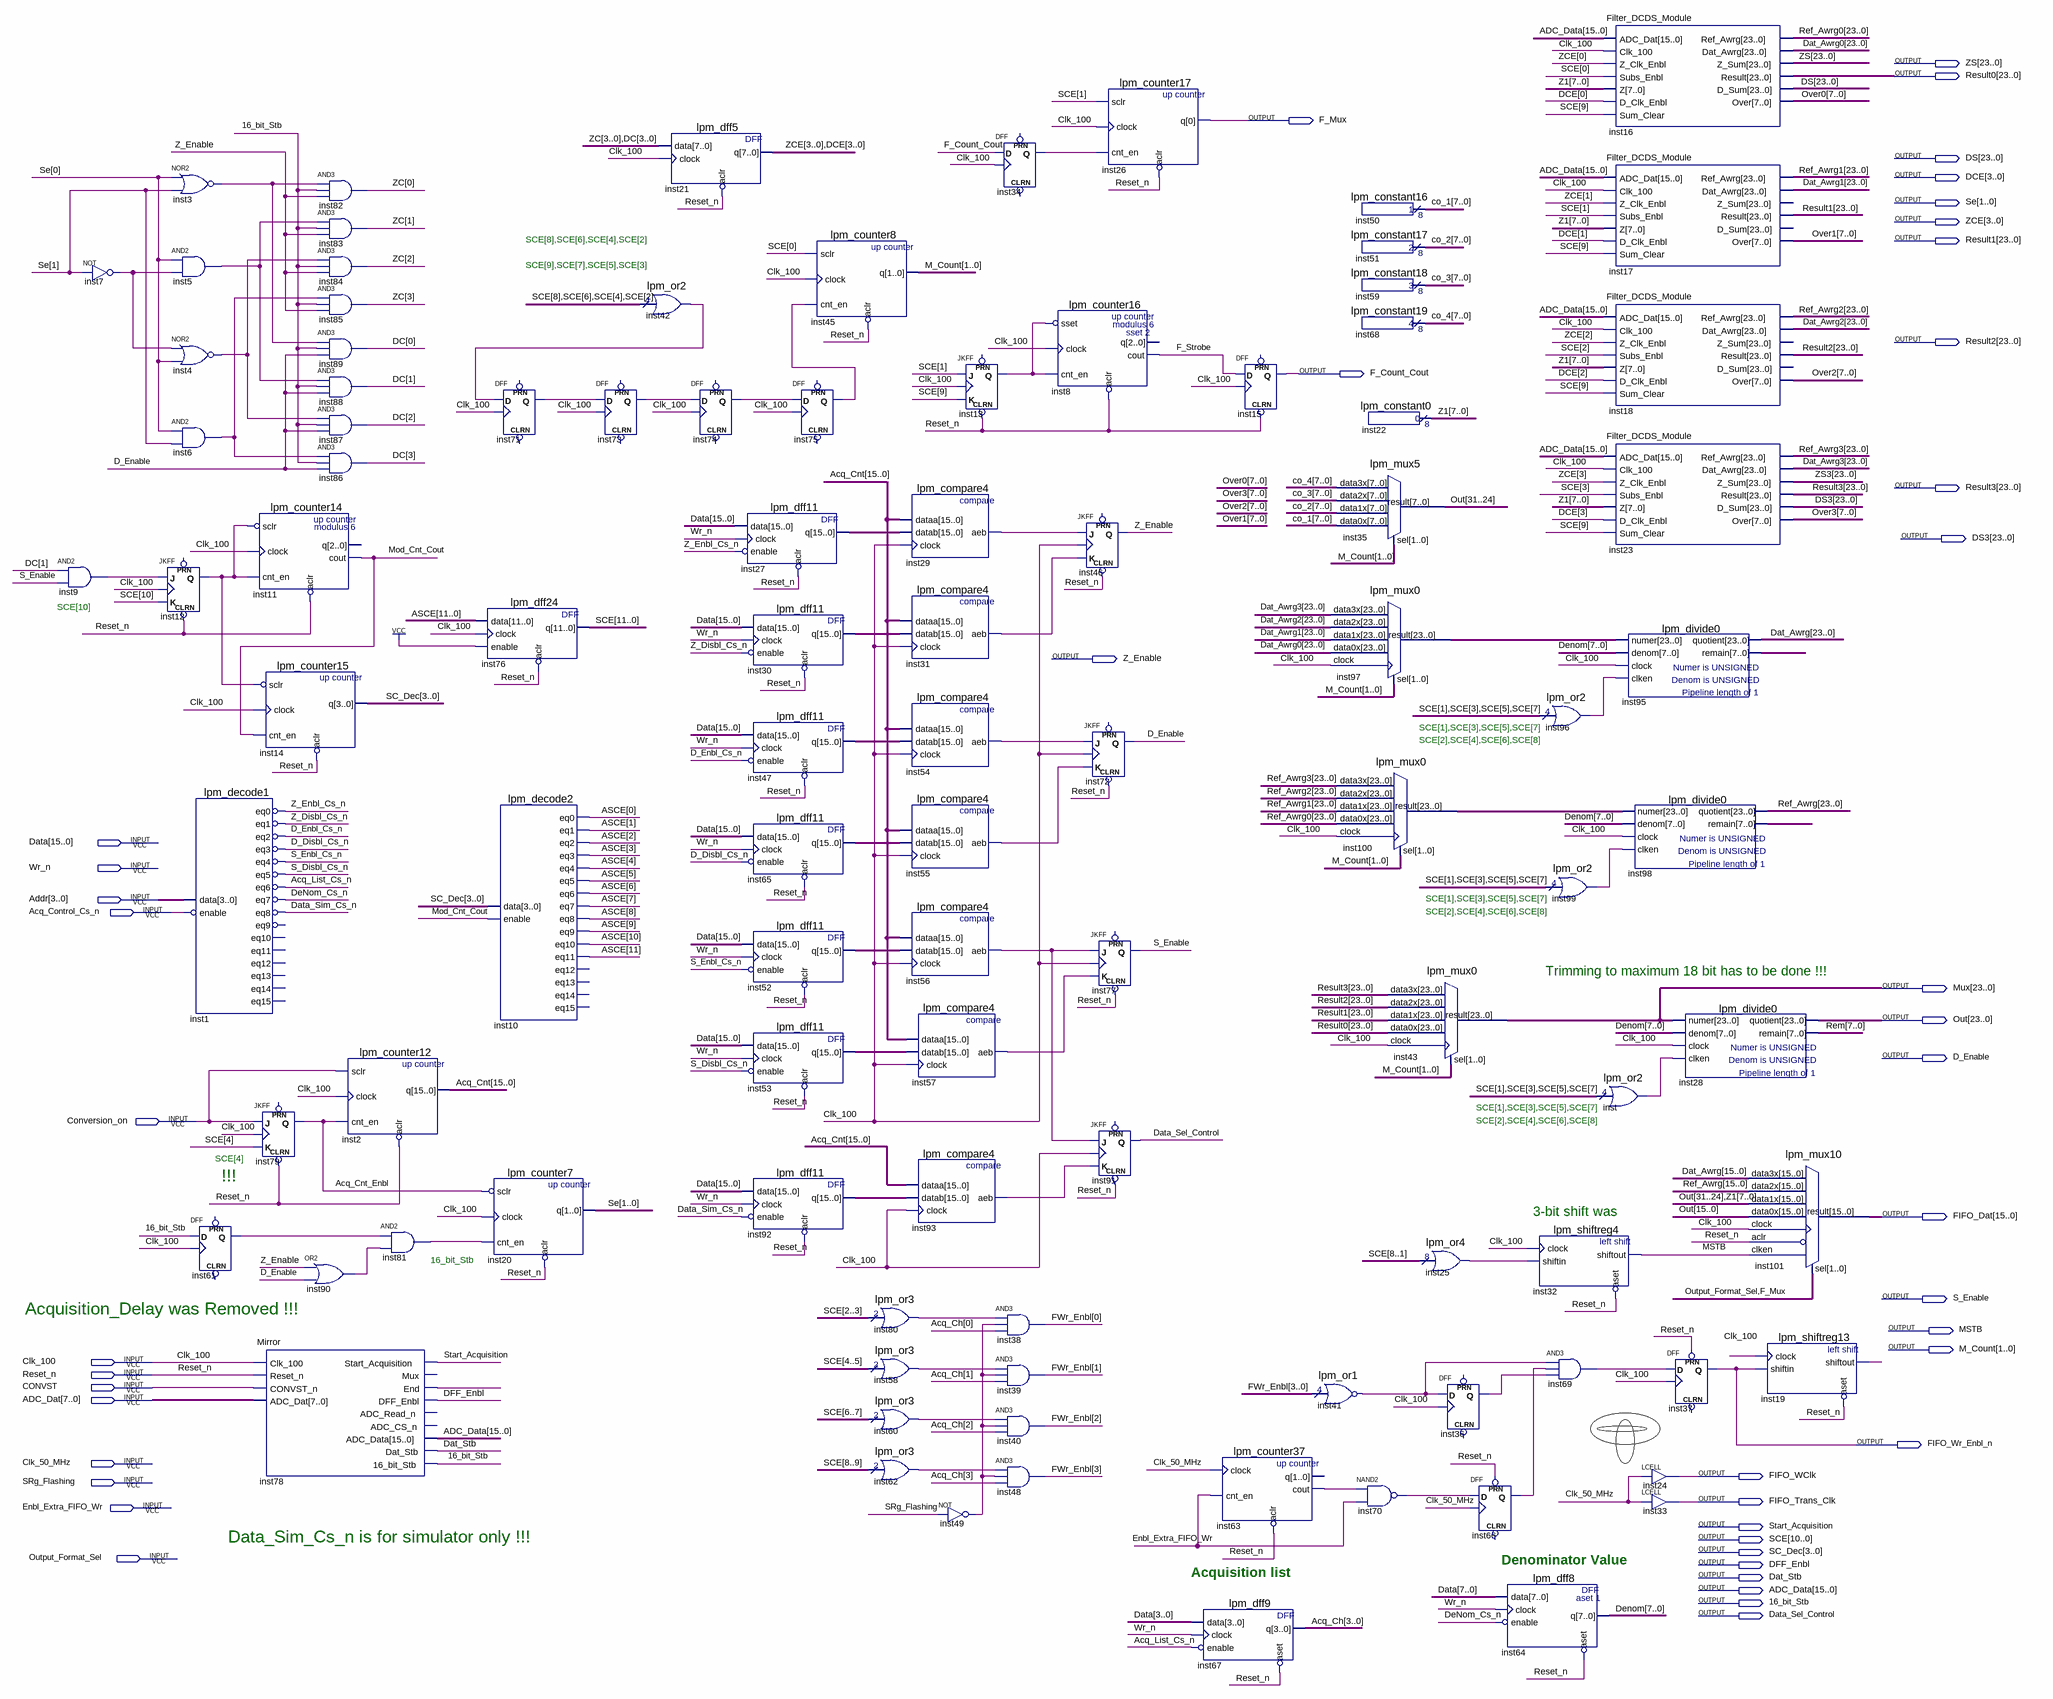
[diagram p0: schematic sheet]
// Quartus schematic Acuisition_Control_Module.bdf as structural Verilog: 100 symbols, 44 pins
module Acuisition_Control_Module (
  input  [15:0] Data,
  input  Wr_n,
  input  [3:0] Addr,
  input  Acq_Control_Cs_n,
  input  Conversion_on,
  input  Clk_100,
  input  Reset_n,
  input  CONVST,
  input  [7:0] ADC_Dat,
  input  Clk_50_MHz,
  input  SRg_Flashing,
  input  Enbl_Extra_FIFO_Wr,
  input  Output_Format_Sel,
  output [23:0] ZS,
  output [23:0] Result0,
  output F_Mux,
  output [23:0] DS,
  output [3:0] DCE,
  output [1:0] Se,
  output [3:0] ZCE,
  output [23:0] Result1,
  output [23:0] Result2,
  output F_Count_Cout,
  output [23:0] Result3,
  output [23:0] DS3,
  output Z_Enable,
  output [23:0] Mux,
  output [31:0] Out,
  output D_Enable,
  output [15:0] FIFO_Dat,
  output S_Enable,
  output MSTB,
  output [1:0] M_Count,
  output FIFO_Wr_Enbl_n,
  output FIFO_WClk,
  output FIFO_Trans_Clk,
  output Start_Acquisition,
  output [11:0] SCE,
  output [3:0] SC_Dec,
  output DFF_Enbl,
  output Dat_Stb,
  output [15:0] ADC_Data,
  output \16_bit_Stb ,
  output Data_Sel_Control
);

  wire Acq_Cnt_Enbl, Acq_List_Cs_n, D_Disbl_Cs_n, D_Enbl_Cs_n, Data_Sim_Cs_n, DeNom_Cs_n, F_Strobe,
       inst1_eq0, inst1_eq1, inst1_eq2, inst1_eq3, inst1_eq4, inst1_eq5, inst1_eq6, inst1_eq7, inst1_eq8,
       inst3_out, inst4_out, inst5_out, inst6_out, inst7_out, inst9_out, inst12_q, inst13_q, inst19_shiftout,
       inst25_result, inst29_aeb, inst31_aeb, inst34_q, inst36_q, inst41_result, inst41_result_inverted_out,
       inst42_result, inst49_out, inst54_aeb, inst55_aeb, inst56_aeb, inst57_aeb, inst58_result,
       inst60_result, inst61_q, inst62_result, inst63_cout, inst66_q, inst69_out, inst70_out, inst71_q,
       inst73_q, inst74_q, inst75_q, inst78_end, inst80_result, inst81_out, inst90_out, inst93_aeb,
       inst96_result, inst99_result, inst_result, Mod_Cnt_Cout, S_Disbl_Cs_n, S_Enbl_Cs_n, Z_Disbl_Cs_n,
       Z_Enbl_Cs_n;
  wire [3:0] Acq_Ch, DC, FWr_Enbl, ZC;
  wire [7:0] co_1, co_2, co_3, co_4, Denom, inst95_remain, inst98_remain, Over0, Over1, Over2, Over3, Rem, Z1;
  wire [11:0] ASCE;
  wire [15:0] Acq_Cnt, inst27_q, inst30_q, inst47_q, inst52_q, inst53_q, inst65_q, inst92_q;
  wire [23:0] Dat_Awrg, Dat_Awrg0, Dat_Awrg1, Dat_Awrg2, Dat_Awrg3, inst97_result, inst100_result, Ref_Awrg,
       Ref_Awrg0, Ref_Awrg1, Ref_Awrg2, Ref_Awrg3, ZS3;

  and inst9 (inst9_out, DC[1], S_Enable);
  not inst7 (inst7_out, Se[1]);
  JKFF inst12 (.CLRN(Reset_n), .K(SCE[10]), .J(inst9_out), .CLK(Clk_100), .Q(inst12_q));  // open: PRN
  nor inst3 (inst3_out, Se[0], Se[1]);
  and inst5 (inst5_out, Se[0], inst7_out);
  nor inst4 (inst4_out, inst7_out, Se[0]);
  and inst6 (inst6_out, Se[0], Se[1]);
  lpm_decode1 inst1 (
    .data(Addr), .enable(~Acq_Control_Cs_n), .eq0(inst1_eq0), .eq1(inst1_eq1), .eq2(inst1_eq2),
    .eq3(inst1_eq3), .eq4(inst1_eq4), .eq5(inst1_eq5), .eq6(inst1_eq6), .eq7(inst1_eq7), .eq8(inst1_eq8));  // open: eq9, eq10, eq11, eq12, eq13, eq14, eq15
  not inst1_eq0_inverted (Z_Enbl_Cs_n, inst1_eq0);
  not inst1_eq1_inverted (Z_Disbl_Cs_n, inst1_eq1);
  not inst1_eq2_inverted (D_Enbl_Cs_n, inst1_eq2);
  not inst1_eq3_inverted (D_Disbl_Cs_n, inst1_eq3);
  not inst1_eq4_inverted (S_Enbl_Cs_n, inst1_eq4);
  not inst1_eq5_inverted (S_Disbl_Cs_n, inst1_eq5);
  not inst1_eq6_inverted (Acq_List_Cs_n, inst1_eq6);
  not inst1_eq7_inverted (DeNom_Cs_n, inst1_eq7);
  not inst1_eq8_inverted (Data_Sim_Cs_n, inst1_eq8);
  DFF inst61 (.CLK(Clk_100), .D(\16_bit_Stb ), .Q(inst61_q));  // open: CLRN, PRN
  lpm_counter14 inst11 (
    .sclr(~inst12_q), .clock(Clk_100), .cnt_en(inst12_q), .aclr(~Reset_n), .cout(Mod_Cnt_Cout));  // open: q
  lpm_counter15 inst14 (.sclr(~inst12_q), .clock(Clk_100), .cnt_en(Mod_Cnt_Cout), .aclr(~Reset_n), .q(SC_Dec));
  JKFF inst79 (.CLRN(Reset_n), .K(SCE[4]), .J(Conversion_on), .CLK(Clk_100), .Q(Acq_Cnt_Enbl));  // open: PRN
  Mirror inst78 (
    .Clk_100(Clk_100), .Reset_n(Reset_n), .CONVST_n(CONVST), .ADC_Dat(ADC_Dat),
    .Start_Acquisition(Start_Acquisition), .End(inst78_end), .DFF_Enbl(DFF_Enbl), .ADC_Data(ADC_Data),
    .Dat_Stb(Dat_Stb), .\16_bit_Stb (\16_bit_Stb ));  // open: Mux, ADC_Read_n, ADC_CS_n
  or inst90 (inst90_out, Z_Enable, D_Enable);
  and inst82 (ZC[0], inst3_out, \16_bit_Stb , Z_Enable);
  and inst83 (ZC[1], inst5_out, \16_bit_Stb , Z_Enable);
  and inst84 (ZC[2], inst4_out, \16_bit_Stb , Z_Enable);
  and inst85 (ZC[3], inst6_out, \16_bit_Stb , Z_Enable);
  and inst89 (DC[0], inst3_out, \16_bit_Stb , D_Enable);
  and inst88 (DC[1], inst5_out, \16_bit_Stb , D_Enable);
  and inst87 (DC[2], inst4_out, \16_bit_Stb , D_Enable);
  and inst86 (DC[3], inst6_out, \16_bit_Stb , D_Enable);
  lpm_counter12 inst2 (.sclr(Conversion_on), .clock(Clk_100), .cnt_en(Acq_Cnt_Enbl), .aclr(~Reset_n), .q(Acq_Cnt));
  and inst81 (inst81_out, inst61_q, inst90_out);
  DFF inst71 (.CLK(Clk_100), .D(inst42_result), .Q(inst71_q));  // open: CLRN, PRN
  lpm_dff24 inst76 (.data(ASCE), .clock(Clk_100), .enable(1'b1), .aclr(~Reset_n), .q(SCE));
  lpm_decode2 inst10 (
    .data(SC_Dec), .enable(Mod_Cnt_Cout), .eq0(ASCE[0]), .eq1(ASCE[1]), .eq2(ASCE[2]), .eq3(ASCE[3]),
    .eq4(ASCE[4]), .eq5(ASCE[5]), .eq6(ASCE[6]), .eq7(ASCE[7]), .eq8(ASCE[8]), .eq9(ASCE[9]),
    .eq10(ASCE[10]), .eq11(ASCE[11]));  // open: eq12, eq13, eq14, eq15
  lpm_counter7 inst20 (.sclr(~Acq_Cnt_Enbl), .clock(Clk_100), .cnt_en(inst81_out), .aclr(~Reset_n), .q(Se));
  DFF inst73 (.CLK(Clk_100), .D(inst71_q), .Q(inst73_q));  // open: CLRN, PRN
  lpm_dff5 inst21 (.data({ZC, DC}), .clock(Clk_100), .aclr(~Reset_n), .q({ZCE, DCE}));
  lpm_or2 inst42 (.data({SCE[8], SCE[6], SCE[4], SCE[2]}), .result(inst42_result));
  DFF inst74 (.CLK(Clk_100), .D(inst73_q), .Q(inst74_q));  // open: CLRN, PRN
  lpm_dff11 inst27 (.data(Data), .clock(Wr_n), .enable(~Z_Enbl_Cs_n), .aclr(~Reset_n), .q(inst27_q));
  lpm_dff11 inst30 (.data(Data), .clock(Wr_n), .enable(~Z_Disbl_Cs_n), .aclr(~Reset_n), .q(inst30_q));
  lpm_dff11 inst47 (.data(Data), .clock(Wr_n), .enable(~D_Enbl_Cs_n), .aclr(~Reset_n), .q(inst47_q));
  lpm_dff11 inst65 (.data(Data), .clock(Wr_n), .enable(~D_Disbl_Cs_n), .aclr(~Reset_n), .q(inst65_q));
  lpm_dff11 inst52 (.data(Data), .clock(Wr_n), .enable(~S_Enbl_Cs_n), .aclr(~Reset_n), .q(inst52_q));
  lpm_dff11 inst53 (.data(Data), .clock(Wr_n), .enable(~S_Disbl_Cs_n), .aclr(~Reset_n), .q(inst53_q));
  lpm_dff11 inst92 (.data(Data), .clock(Wr_n), .enable(~Data_Sim_Cs_n), .aclr(~Reset_n), .q(inst92_q));
  lpm_counter8 inst45 (.sclr(SCE[0]), .clock(Clk_100), .cnt_en(inst75_q), .aclr(~Reset_n), .q(M_Count));
  DFF inst75 (.CLK(Clk_100), .D(inst74_q), .Q(inst75_q));  // open: CLRN, PRN
  lpm_or3 inst80 (.data({SCE[2], SCE[3]}), .result(inst80_result));
  lpm_or3 inst58 (.data({SCE[4], SCE[5]}), .result(inst58_result));
  lpm_or3 inst60 (.data({SCE[6], SCE[7]}), .result(inst60_result));
  lpm_or3 inst62 (.data({SCE[8], SCE[9]}), .result(inst62_result));
  lpm_compare4 inst29 (.dataa(Acq_Cnt), .datab(inst27_q), .clock(Clk_100), .aeb(inst29_aeb));
  lpm_compare4 inst31 (.dataa(Acq_Cnt), .datab(inst30_q), .clock(Clk_100), .aeb(inst31_aeb));
  lpm_compare4 inst54 (.dataa(Acq_Cnt), .datab(inst47_q), .clock(Clk_100), .aeb(inst54_aeb));
  lpm_compare4 inst55 (.dataa(Acq_Cnt), .datab(inst65_q), .clock(Clk_100), .aeb(inst55_aeb));
  lpm_compare4 inst56 (.dataa(Acq_Cnt), .datab(inst52_q), .clock(Clk_100), .aeb(inst56_aeb));
  lpm_compare4 inst57 (.dataa(Acq_Cnt), .datab(inst53_q), .clock(Clk_100), .aeb(inst57_aeb));
  lpm_compare4 inst93 (.dataa(Acq_Cnt), .datab(inst92_q), .clock(Clk_100), .aeb(inst93_aeb));
  JKFF inst13 (.CLRN(Reset_n), .K(SCE[9]), .J(SCE[1]), .CLK(Clk_100), .Q(inst13_q));  // open: PRN
  not inst49 (inst49_out, SRg_Flashing);
  DFF inst34 (.CLK(Clk_100), .D(F_Count_Cout), .Q(inst34_q));  // open: CLRN, PRN
  and inst38 (FWr_Enbl[0], inst80_result, inst49_out, Acq_Ch[0]);
  and inst39 (FWr_Enbl[1], inst58_result, inst49_out, Acq_Ch[1]);
  and inst40 (FWr_Enbl[2], inst60_result, inst49_out, Acq_Ch[2]);
  and inst48 (FWr_Enbl[3], inst62_result, inst49_out, Acq_Ch[3]);
  lpm_counter16 inst8 (
    .sset(~inst13_q), .clock(Clk_100), .cnt_en(inst13_q), .aclr(~Reset_n), .cout(F_Strobe));  // open: q
  lpm_counter17 inst26 (.sclr(SCE[1]), .clock(Clk_100), .cnt_en(inst34_q), .aclr(~Reset_n), .q(F_Mux));
  JKFF inst46 (.CLRN(Reset_n), .K(inst31_aeb), .J(inst29_aeb), .CLK(Clk_100), .Q(Z_Enable));  // open: PRN
  JKFF inst72 (.CLRN(Reset_n), .K(inst55_aeb), .J(inst54_aeb), .CLK(Clk_100), .Q(D_Enable));  // open: PRN
  JKFF inst77 (.CLRN(Reset_n), .K(inst57_aeb), .J(inst56_aeb), .CLK(Clk_100), .Q(S_Enable));  // open: PRN
  JKFF inst91 (.CLRN(Reset_n), .K(inst93_aeb), .J(inst56_aeb), .CLK(Clk_100), .Q(Data_Sel_Control));  // open: PRN
  lpm_counter37 inst63 (
    .clock(Clk_50_MHz), .cnt_en(Enbl_Extra_FIFO_Wr), .aclr(~Reset_n), .cout(inst63_cout));  // open: q
  lpm_dff9 inst67 (.data(Data[3:0]), .clock(Wr_n), .enable(~Acq_List_Cs_n), .aset(~Reset_n), .q(Acq_Ch));
  DFF inst15 (.CLRN(Reset_n), .CLK(Clk_100), .D(F_Strobe), .Q(F_Count_Cout));  // open: PRN
  lpm_or1 inst41 (.data(FWr_Enbl), .result(inst41_result));
  not inst41_result_inverted (inst41_result_inverted_out, inst41_result);
  lpm_constant16 inst50 (.result(co_1));
  lpm_constant17 inst51 (.result(co_2));
  lpm_constant18 inst59 (.result(co_3));
  lpm_constant19 inst68 (.result(co_4));
  lpm_constant0 inst22 (.result(Z1));
  lpm_mux5 inst35 (.data3x(co_4), .data2x(co_3), .data1x(co_2), .data0x(co_1), .sel(M_Count), .result(Out[31:24]));
  lpm_mux0 inst97 (
    .data3x(Dat_Awrg3), .data2x(Dat_Awrg2), .data1x(Dat_Awrg1), .data0x(Dat_Awrg0), .clock(Clk_100),
    .sel(M_Count), .result(inst97_result));
  lpm_mux0 inst100 (
    .data3x(Ref_Awrg3), .data2x(Ref_Awrg2), .data1x(Ref_Awrg1), .data0x(Ref_Awrg0), .clock(Clk_100),
    .sel(M_Count), .result(inst100_result));
  nand inst70 (inst70_out, inst63_cout, Enbl_Extra_FIFO_Wr);
  lpm_mux0 inst43 (
    .data3x(Result3), .data2x(Result2), .data1x(Result1), .data0x(Result0), .clock(Clk_100), .sel(M_Count),
    .result(Mux));
  lpm_or4 inst25 (.data(SCE[8:1]), .result(inst25_result));
  DFF inst36 (.CLK(Clk_100), .D(inst41_result_inverted_out), .Q(inst36_q));  // open: CLRN, PRN
  DFF inst66 (.CLK(Clk_50_MHz), .D(inst70_out), .PRN(Reset_n), .Q(inst66_q));  // open: CLRN
  lpm_shiftreg4 inst32 (.clock(Clk_100), .shiftin(inst25_result), .aset(~Reset_n), .shiftout(MSTB));
  lpm_dff8 inst64 (.data(Data[7:0]), .clock(Wr_n), .enable(~DeNom_Cs_n), .aset(~Reset_n), .q(Denom));
  lpm_or2 inst96 (.data({SCE[1], SCE[3], SCE[5], SCE[7]}), .result(inst96_result));
  lpm_or2 inst99 (.data({SCE[1], SCE[3], SCE[5], SCE[7]}), .result(inst99_result));
  and inst69 (inst69_out, inst41_result_inverted_out, inst66_q, inst36_q);
  Filter_DCDS_Module inst16 (
    .ADC_Dat(ADC_Data), .Clk_100(Clk_100), .Z_Clk_Enbl(ZCE[0]), .Subs_Enbl(SCE[0]), .Z(Z1),
    .D_Clk_Enbl(DCE[0]), .Sum_Clear(SCE[9]), .Ref_Awrg(Ref_Awrg0), .Dat_Awrg(Dat_Awrg0), .Z_Sum(ZS),
    .Result(Result0), .D_Sum(DS), .Over(Over0));
  Filter_DCDS_Module inst17 (
    .ADC_Dat(ADC_Data), .Clk_100(Clk_100), .Z_Clk_Enbl(ZCE[1]), .Subs_Enbl(SCE[1]), .Z(Z1),
    .D_Clk_Enbl(DCE[1]), .Sum_Clear(SCE[9]), .Ref_Awrg(Ref_Awrg1), .Dat_Awrg(Dat_Awrg1), .Result(Result1),
    .Over(Over1));  // open: Z_Sum, D_Sum
  Filter_DCDS_Module inst18 (
    .ADC_Dat(ADC_Data), .Clk_100(Clk_100), .Z_Clk_Enbl(ZCE[2]), .Subs_Enbl(SCE[2]), .Z(Z1),
    .D_Clk_Enbl(DCE[2]), .Sum_Clear(SCE[9]), .Ref_Awrg(Ref_Awrg2), .Dat_Awrg(Dat_Awrg2), .Result(Result2),
    .Over(Over2));  // open: Z_Sum, D_Sum
  Filter_DCDS_Module inst23 (
    .ADC_Dat(ADC_Data), .Clk_100(Clk_100), .Z_Clk_Enbl(ZCE[3]), .Subs_Enbl(SCE[3]), .Z(Z1),
    .D_Clk_Enbl(DCE[3]), .Sum_Clear(SCE[9]), .Ref_Awrg(Ref_Awrg3), .Dat_Awrg(Dat_Awrg3), .Z_Sum(ZS3),
    .Result(Result3), .D_Sum(DS3), .Over(Over3));
  lpm_divide0 inst95 (
    .numer(inst97_result), .denom(Denom), .clock(Clk_100), .clken(inst96_result), .quotient(Dat_Awrg),
    .remain(inst95_remain));
  lpm_divide0 inst98 (
    .numer(inst100_result), .denom(Denom), .clock(Clk_100), .clken(inst99_result), .quotient(Ref_Awrg),
    .remain(inst98_remain));
  lpm_or2 inst (.data({SCE[1], SCE[3], SCE[5], SCE[7]}), .result(inst_result));
  lpm_divide0 inst28 (
    .numer(Mux), .denom(Denom), .clock(Clk_100), .clken(inst_result), .quotient(Out[23:0]), .remain(Rem));
  DFF inst37 (.CLK(Clk_100), .D(inst69_out), .PRN(Reset_n), .Q(FIFO_Wr_Enbl_n));  // open: CLRN
  LCELL inst24 (.IN(Clk_50_MHz), .OUT(FIFO_WClk));
  LCELL inst33 (.IN(Clk_50_MHz), .OUT(FIFO_Trans_Clk));
  lpm_mux10 inst101 (
    .data3x(Dat_Awrg[15:0]), .data2x(Ref_Awrg[15:0]), .data1x({Out[31:24], Z1}), .data0x(Out[15:0]),
    .clock(Clk_100), .aclr(~Reset_n), .clken(MSTB), .sel({Output_Format_Sel, F_Mux}), .result(FIFO_Dat));
  lpm_shiftreg13 inst19 (.clock(Clk_100), .shiftin(FIFO_Wr_Enbl_n), .aset(~Reset_n), .shiftout(inst19_shiftout));

  // Notes on the sheet:
  //   SCE[8],SCE[6],SCE[4],SCE[2]
  //   SCE[9],SCE[7],SCE[5],SCE[3]
  //   SCE[10]
  //   SCE[1],SCE[3],SCE[5],SCE[7]
  //   SCE[2],SCE[4],SCE[6],SCE[8]
  //   SCE[1],SCE[3],SCE[5],SCE[7]
  //   SCE[2],SCE[4],SCE[6],SCE[8]
  //   Trimming to maximum 18 bit has to be done !!!
  //   SCE[1],SCE[3],SCE[5],SCE[7]
  //   SCE[2],SCE[4],SCE[6],SCE[8]
  //   SCE[4]
  //   !!!
  //   3-bit shift was
  //   16_bit_Stb
  //   Acquisition_Delay was Removed !!!
  //   Data_Sim_Cs_n is for simulator only !!!
  //   Denominator Value
  //   Acquisition list
endmodule
